# Altium schematic sheet MCU.SchDoc
size A4
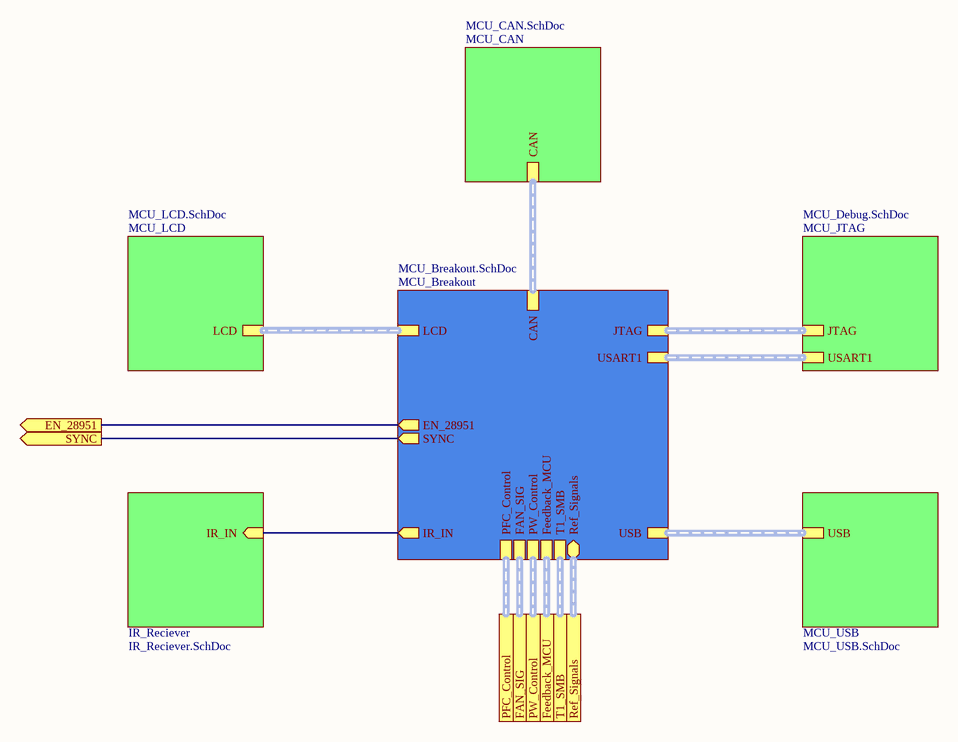
[diagram p0: MCU.SchDoc]

## Sub-sheets
IR_Reciever = IR_Reciever.SchDoc: IR_IN (in)
MCU_Breakout = MCU_Breakout.SchDoc: JTAG (harness JTAG), USB (harness USB), IR_IN (out), CAN (harness FD_CAN), LCD (harness LCD), T1_SMB (harness T1_SMB), Feedback_MCU (harness Feedback_MCU), PW_Control (harness PW_Control), FAN_SIG (harness FAN_SIG), PFC_Control (harness PFC_Control), USART1 (harness USART1), Ref_Signals (bidir, harness Ref_Signals), SYNC (out), EN_28951 (out)
MCU_CAN = MCU_CAN.SchDoc: CAN
MCU_JTAG = MCU_Debug.SchDoc: JTAG (harness JTAG), USART1 (harness USART1)
MCU_LCD = MCU_LCD.SchDoc: LCD
MCU_USB = MCU_USB.SchDoc: USB

## Ports
EN_28951 (out), FAN_SIG (harness FAN_SIG), Feedback_MCU (harness Feedback_MCU), PFC_Control (harness PFC_Control), PW_Control (harness PW_Control), Ref_Signals (harness Ref_Signals), SYNC (out), T1_SMB (harness T1_SMB)

## Nets
EN_28951: port EN_28951, sheet MCU_Breakout/EN_28951
SYNC: port SYNC, sheet MCU_Breakout/SYNC
(unnamed): sheet MCU_Breakout/IR_IN, sheet IR_Reciever/IR_IN

## Buses and harness runs
harness port FAN_SIG = sheet MCU_Breakout/FAN_SIG
harness port Feedback_MCU = sheet MCU_Breakout/Feedback_MCU
harness port PFC_Control = sheet MCU_Breakout/PFC_Control
harness port PW_Control = sheet MCU_Breakout/PW_Control
harness port Ref_Signals = sheet MCU_Breakout/Ref_Signals
harness port T1_SMB = sheet MCU_Breakout/T1_SMB
harness sheet MCU_Breakout/CAN = sheet MCU_CAN/CAN
harness sheet MCU_Breakout/JTAG = sheet MCU_JTAG/JTAG
harness sheet MCU_Breakout/LCD = sheet MCU_LCD/LCD
harness sheet MCU_Breakout/USART1 = sheet MCU_JTAG/USART1
harness sheet MCU_Breakout/USB = sheet MCU_USB/USB